# Altium schematic sheet CPLD_CLK_V2.0.SchDoc
size 254 x 241 mm
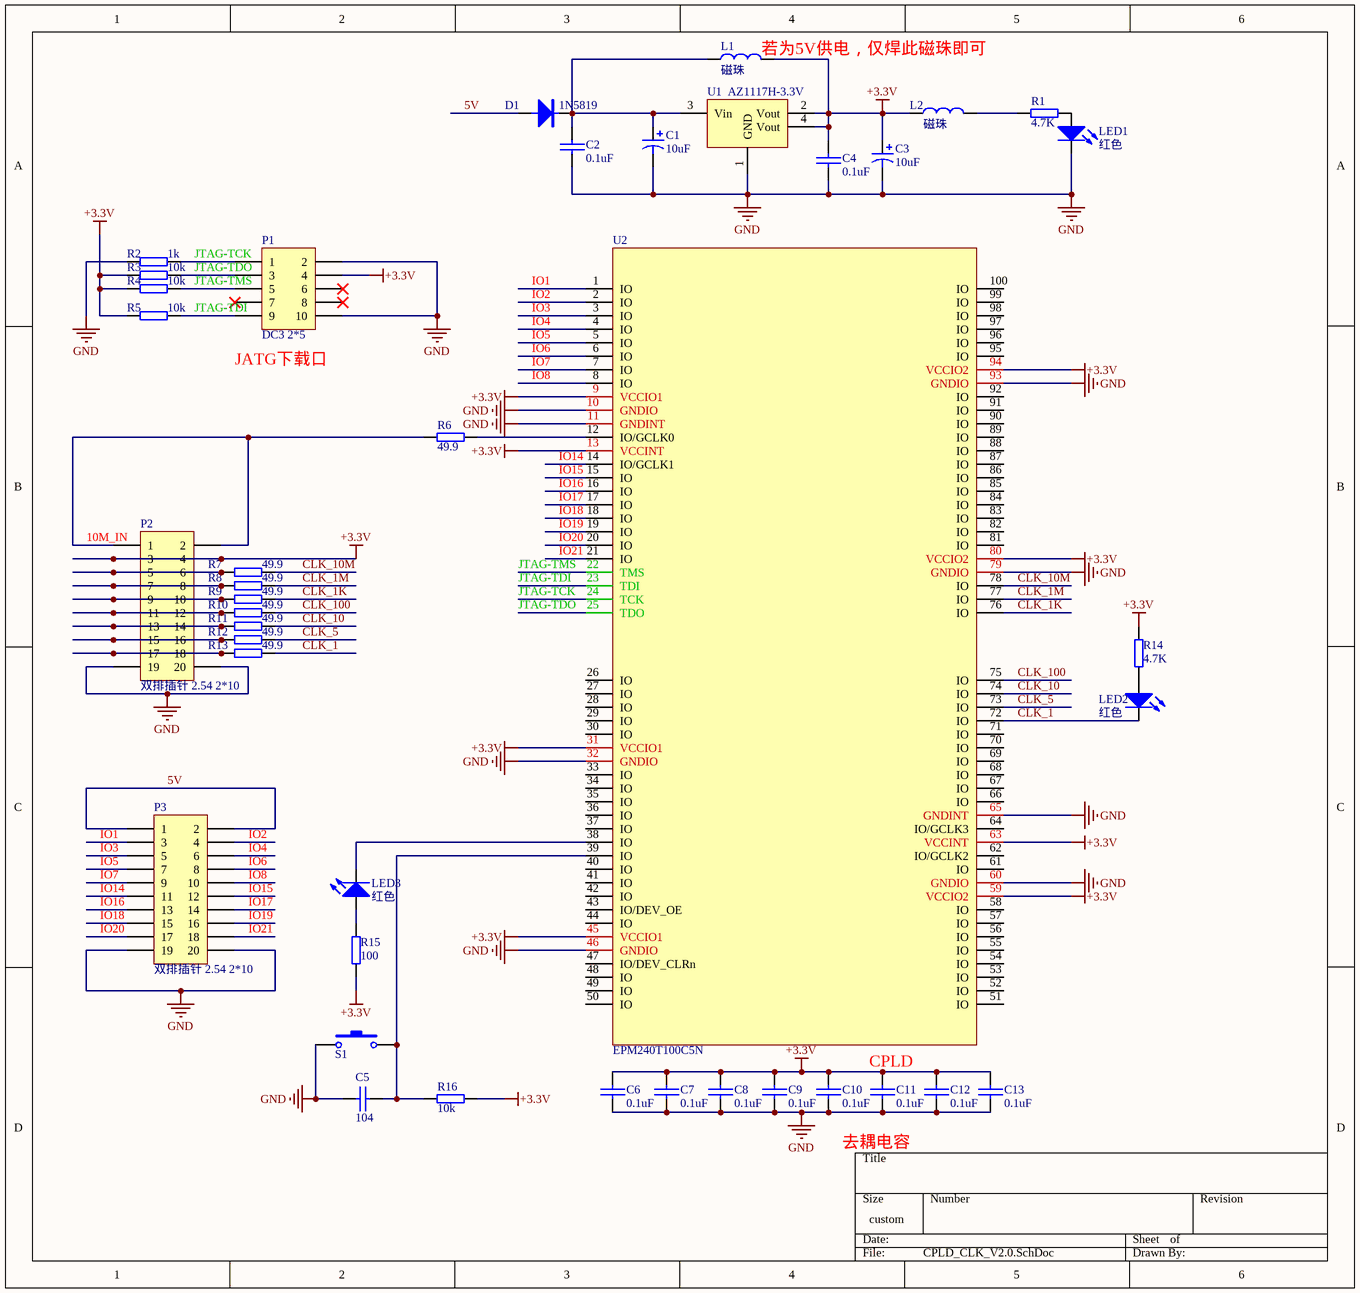
[diagram p0: CPLD_CLK_V2.0.SchDoc]

## Parts
C1  10uF  [1206]
C2  0.1uF  [0805]
C3  10uF  [1206]
C4  0.1uF  [0805]
C5  104  [0805]
C6  0.1uF  [0805]
C7  0.1uF  [0805]
C8  0.1uF  [0805]
C9  0.1uF  [0805]
C10  0.1uF  [0805]
C11  0.1uF  [0805]
C12  0.1uF  [0805]
C13  0.1uF  [0805]
D1  1N5819  [二极管 贴片 2010]
L1  磁珠  [0805]
L2  磁珠  [0805]
LED1  红色  [LED0805]
LED2  红色  [LED0805]
LED3  红色  [LED0805]
P1  封装: DC3 2*5  [双排插针 2.54 2*5]  (hidden comment: DC3压线座)
P2  双排插针2.54 2*10  [双排插针 2.54 2*10]  (value not drawn)
P3  双排插针2.54 2*10  [双排插针 2.54 2*10]  (value not drawn)
R1  4.7K  [0805]
R2  1k  [0805]
R3  10k  [0805]
R4  10k  [0805]
R5  10k  [0805]
R6  49.9  [0805]
R7  49.9  [0805]
R8  49.9  [0805]
R9  49.9  [0805]
R10  49.9  [0805]
R11  49.9  [0805]
R12  49.9  [0805]
R13  49.9  [0805]
R14  4.7K  [0805]
R15  100  [0805]
R16  10k  [0805]
S1  key  [按键 轻触  6*3]  (value not drawn)
U1  AZ1117H-3.3V  [SOT223]
U2  EPM240T100C5N  [TQFP100]

## Nets
+3.3V: C3.1 C4.2 C6.2 C7.2 C8.2 C9.2 C10.2 C11.2 C12.2 C13.2 L1.2 L2.1 P1.4 P2.3 P2.4 R3.1 R4.1 R5.2 R14.1 R15.2 R16.1 U1.2(Vout) U1.4(Vout) U2.9(VCCIO1) U2.13(VCCINT) U2.31(VCCIO1) U2.45(VCCIO1) U2.59(VCCIO2) U2.63(VCCINT) U2.80(VCCIO2) U2.94(VCCIO2)
GND: C1.2 C2.1 C3.2 C4.1 C5.1 C6.1 C7.1 C8.1 C9.1 C10.1 C11.1 C12.1 C13.1 LED1.2(K) P1.2 P1.10 P2.19 P2.20 P3.19 P3.20 R2.2 S1.1 U1.1(GND) U2.10(GNDIO) U2.11(GNDINT) U2.32(GNDIO) U2.46(GNDIO) U2.60(GNDIO) U2.65(GNDINT) U2.79(GNDIO) U2.93(GNDIO)
5V: D1.1(A) P3.1 P3.2
10M_IN: P2.1 P2.2 R6.2
CLK_1: LED2.2(K) R13.1 U2.72(IO)
CLK_1K: R9.1 U2.76(IO)
CLK_1M: R8.1 U2.77(IO)
CLK_5: R12.1 U2.73(IO)
CLK_10: R11.1 U2.74(IO)
CLK_10M: R7.1 U2.78(IO)
CLK_100: R10.1 U2.75(IO)
IO1: P3.3 U2.1(IO)
IO2: P3.4 U2.2(IO)
IO3: P3.5 U2.3(IO)
IO4: P3.6 U2.4(IO)
IO5: P3.7 U2.5(IO)
IO6: P3.8 U2.6(IO)
IO7: P3.9 U2.7(IO)
IO8: P3.10 U2.8(IO)
IO14: P3.11 U2.14(IO/GCLK1)
IO15: P3.12 U2.15(IO)
IO16: P3.13 U2.16(IO)
IO17: P3.14 U2.17(IO)
IO18: P3.15 U2.18(IO)
IO19: P3.16 U2.19(IO)
IO20: P3.17 U2.20(IO)
IO21: P3.18 U2.21(IO)
JTAG-TCK: P1.1 R2.1 U2.24(TCK)
JTAG-TDI: P1.9 R5.1 U2.23(TDI)
JTAG-TDO: P1.3 R3.2 U2.25(TDO)
JTAG-TMS: P1.5 R4.2 U2.22(TMS)
NetC1_1: C1.1 C2.2 D1.2(K) L1.1 U1.3(Vin)
NetC5_2: C5.2 R16.2 S1.2 U2.39(IO)
NetL2_2: L2.2 R1.2
NetLED1_1: LED1.1(A) R1.1
NetLED2_1: LED2.1(A) R14.2
NetLED3_1: LED3.1(A) R15.1
NetLED3_2: LED3.2(K) U2.38(IO)
NetP2_5: P2.5 P2.6 R7.2
NetP2_7: P2.7 P2.8 R8.2
NetP2_9: P2.9 P2.10 R9.2
NetP2_11: P2.11 P2.12 R10.2
NetP2_13: P2.13 P2.14 R11.2
NetP2_15: P2.15 P2.16 R12.2
NetP2_17: P2.17 P2.18 R13.2
NetR6_1: R6.1 U2.12(IO/GCLK0)

Not connected (* = marked no-connect by the designer): P1 6* 7* 8*; U2 26(IO) 27(IO) 28(IO) 29(IO) 30(IO) 33(IO) 34(IO) 35(IO) 36(IO) 37(IO) 40(IO) 41(IO) 42(IO) 43(IO/DEV_OE) 44(IO) 47(IO/DEV_CLRn) 48(IO) 49(IO) 50(IO) 51(IO) 52(IO) 53(IO) 54(IO) 55(IO) 56(IO) 57(IO) 58(IO) 61(IO) 62(IO/GCLK2) 64(IO/GCLK3) 66(IO) 67(IO) 68(IO) 69(IO) 70(IO) 71(IO) 81(IO) 82(IO) 83(IO) 84(IO) 85(IO) 86(IO) 87(IO) 88(IO) 89(IO) 90(IO) 91(IO) 92(IO) 95(IO) 96(IO) 97(IO) 98(IO) 99(IO) 100(IO)

## Notes on the sheet
- (near L1) 若为5V供电，仅焊此磁珠即可
- (near P1) JATG下载口
- (near C11) CPLD
- 去耦电容

## Library data of the parts
C1 C3 = Cap Pol1: Polarized Capacitor (Radial); Published: 8-Jun-2000; LatestRevisionDate: 17-Jul-2002; LatestRevisionNote: Re-released for DXP Platform.; PackageReference: RB7.6-15; Publisher: Altium Limited; Value: 10uF
C2 C4-C13 = 电容 贴片 0805: 名称: 贴片电容; 单位: 个; 封装: 0805
D1 = 二极管 1N5822: 名称: 二极管; 封装: 直插; 单位: 个
L1 L2 = 磁珠: 单位: 个; 名称: 磁珠; 封装: 0805
LED1-LED3 = 二极管 贴片发光 0805: 名称: 贴片发光二极管; 封装: 0805; 单位: 个
P1 = 联结件 DC3 2*5: 名称: 联结件; 单位: 个
P2 P3 = 联结件 双排插针 2.54 2*10: 名称: 联结件; 单位: 个; 封装: 双排插针 2.54 2*10
R1-R16 = 电阻 贴片 0805: 名称: 贴片电阻; 单位: 个; 封装: 0805
S1 = 按键 轻触 6*6: 单位: 个; 名称: 开关; 封装: 直插 12*12*12
U1 = 贴片芯片 SPX1117M3-5.0: 名称: 贴片芯片; 单位: 个; 封装: SOT223